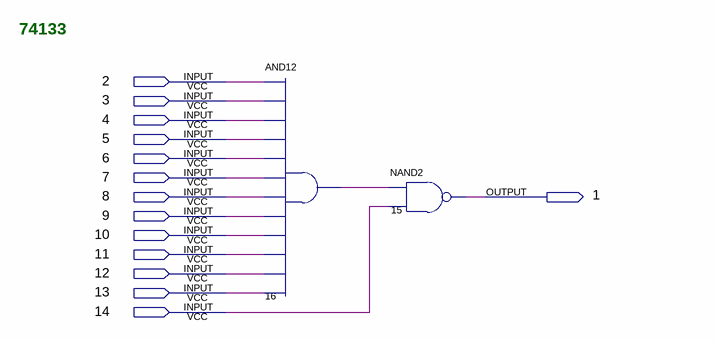
[diagram p0: schematic sheet]
// Quartus schematic 74133.bdf as structural Verilog: 2 symbols, 14 pins
module \74133  (
  input  \2 ,
  input  \3 ,
  input  \4 ,
  input  \5 ,
  input  \6 ,
  input  \7 ,
  input  \8 ,
  input  \9 ,
  input  \10 ,
  input  \11 ,
  input  \12 ,
  input  \13 ,
  input  \14 ,
  output \1 
);

  wire n16_out;

  and u_16 (n16_out, \2 , \3 , \4 , \5 , \6 , \7 , \8 , \9 , \10 , \11 , \12 , \13 );
  nand u_15 (\1 , n16_out, \14 );

  // Notes on the sheet:
  //   74133
endmodule
